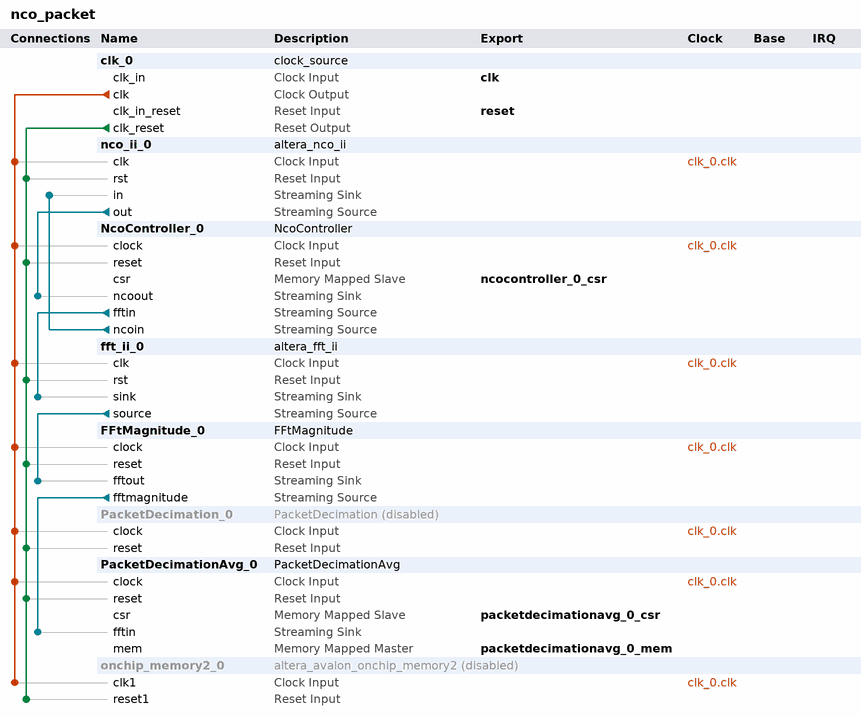
[diagram p0: system contents]
# Platform Designer (Qsys) system nco_packet, Cyclone V 5CSEBA6U23I7
# Parameters at their usual value, and those the tool derives, are not listed.
package require -exact qsys 20.1
create_system nco_packet
set_project_property DEVICE_FAMILY {Cyclone V}
set_project_property DEVICE 5CSEBA6U23I7

add_instance clk_0 clock_source 20.1
set_instance_parameter_value clk_0 clockFrequency 50000000

add_instance nco_ii_0 altera_nco_ii 20.1
set_instance_parameter_value nco_ii_0 apr 32
set_instance_parameter_value nco_ii_0 apri 16
set_instance_parameter_value nco_ii_0 arch large_rom
set_instance_parameter_value nco_ii_0 dpri 5
set_instance_parameter_value nco_ii_0 freq_out 1.0
set_instance_parameter_value nco_ii_0 fsamp 50.0
set_instance_parameter_value nco_ii_0 mpr 16
set_instance_parameter_value nco_ii_0 selected_device_family {Cyclone V}
set_instance_parameter_value nco_ii_0 want_sin_and_cos single_output

add_instance NcoController_0 NcoController 1.0
set_instance_parameter_value NcoController_0 CLK_FREQ 50000000
set_instance_parameter_value NcoController_0 FFT_WIDTH 16
set_instance_parameter_value NcoController_0 FIFO_DEPTH 256
set_instance_parameter_value NcoController_0 NCO_PHASE_WIDTH 32
set_instance_parameter_value NcoController_0 NCO_WIDTH 16
set_instance_parameter_value NcoController_0 PACKET_LEN 256

add_instance fft_ii_0 altera_fft_ii 20.1
set_instance_parameter_value fft_ii_0 data_flow {Variable Streaming}
set_instance_parameter_value fft_ii_0 data_rep {Fixed Point}
set_instance_parameter_value fft_ii_0 engine_arch {Quad Output}
set_instance_parameter_value fft_ii_0 in_width 16
set_instance_parameter_value fft_ii_0 length 256
set_instance_parameter_value fft_ii_0 out_order {Digit Reverse}
set_instance_parameter_value fft_ii_0 out_width 16
set_instance_parameter_value fft_ii_0 twid_width 8

add_instance FFtMagnitude_0 FFtMagnitude 1.0
set_instance_parameter_value FFtMagnitude_0 FFT_WIDTH 16
set_instance_parameter_value FFtMagnitude_0 PACKET_LEN 256

add_instance PacketDecimation_0 PacketDecimation 1.0
set_instance_property PacketDecimation_0 ENABLED false
set_instance_parameter_value PacketDecimation_0 CLK_FREQ 50000000
set_instance_parameter_value PacketDecimation_0 DATA_WIDTH 16
set_instance_parameter_value PacketDecimation_0 FIX_ADDRESS_WIDTH 16
set_instance_parameter_value PacketDecimation_0 PACKET_LEN 256
set_instance_parameter_value PacketDecimation_0 PACKET_RATE 60
set_instance_parameter_value PacketDecimation_0 USE_FIX_ADDRESS_WIDTH 0

add_instance PacketDecimationAvg_0 PacketDecimationAvg 1.0
set_instance_parameter_value PacketDecimationAvg_0 CLK_FREQ 50000000
set_instance_parameter_value PacketDecimationAvg_0 DATA_WIDTH 16
set_instance_parameter_value PacketDecimationAvg_0 FIX_ADDRESS_WIDTH 32
set_instance_parameter_value PacketDecimationAvg_0 PACKET_LEN 256
set_instance_parameter_value PacketDecimationAvg_0 PACKET_RATE 60
set_instance_parameter_value PacketDecimationAvg_0 USE_FIX_ADDRESS_WIDTH 0

add_instance onchip_memory2_0 altera_avalon_onchip_memory2 20.1
set_instance_property onchip_memory2_0 ENABLED false
set_instance_parameter_value onchip_memory2_0 allowInSystemMemoryContentEditor true
set_instance_parameter_value onchip_memory2_0 dataWidth 16
set_instance_parameter_value onchip_memory2_0 dualPort false
set_instance_parameter_value onchip_memory2_0 initMemContent false
set_instance_parameter_value onchip_memory2_0 initializationFileName onchip_mem.hex
set_instance_parameter_value onchip_memory2_0 instanceID test
set_instance_parameter_value onchip_memory2_0 memorySize 16384

# connections
add_connection clk_0.clk fft_ii_0.clk clock
add_connection clk_0.clk FFtMagnitude_0.clock clock
add_connection clk_0.clk nco_ii_0.clk clock
add_connection clk_0.clk NcoController_0.clock clock
add_connection clk_0.clk onchip_memory2_0.clk1 clock
add_connection clk_0.clk PacketDecimation_0.clock clock
add_connection clk_0.clk PacketDecimationAvg_0.clock clock
add_connection clk_0.clk_reset fft_ii_0.rst reset
add_connection clk_0.clk_reset FFtMagnitude_0.reset reset
add_connection clk_0.clk_reset nco_ii_0.rst reset
add_connection clk_0.clk_reset NcoController_0.reset reset
add_connection clk_0.clk_reset onchip_memory2_0.reset1 reset
add_connection clk_0.clk_reset PacketDecimation_0.reset reset
add_connection clk_0.clk_reset PacketDecimationAvg_0.reset reset
add_connection fft_ii_0.source FFtMagnitude_0.fftout avalon_streaming
add_connection FFtMagnitude_0.fftmagnitude PacketDecimationAvg_0.fftin avalon_streaming
add_connection nco_ii_0.out NcoController_0.ncoout avalon_streaming
add_connection NcoController_0.fftin fft_ii_0.sink avalon_streaming
add_connection NcoController_0.ncoin nco_ii_0.in avalon_streaming

# exported interfaces
add_interface clk clock sink
set_interface_property clk EXPORT_OF clk_0.clk_in
add_interface ncocontroller_0_csr avalon slave
set_interface_property ncocontroller_0_csr EXPORT_OF NcoController_0.csr
add_interface packetdecimationavg_0_csr avalon slave
set_interface_property packetdecimationavg_0_csr EXPORT_OF PacketDecimationAvg_0.csr
add_interface packetdecimationavg_0_mem avalon master
set_interface_property packetdecimationavg_0_mem EXPORT_OF PacketDecimationAvg_0.mem
add_interface reset reset sink
set_interface_property reset EXPORT_OF clk_0.clk_in_reset

set_interconnect_requirement {$system} qsys_mm.clockCrossingAdapter HANDSHAKE
set_interconnect_requirement {$system} qsys_mm.enableEccProtection FALSE
set_interconnect_requirement {$system} qsys_mm.insertDefaultSlave FALSE
set_interconnect_requirement {$system} qsys_mm.maxAdditionalLatency 1

save_system nco_packet.qsys
